# EAGLE design sensor otomatis ldr (EAGLE 6.6.0)
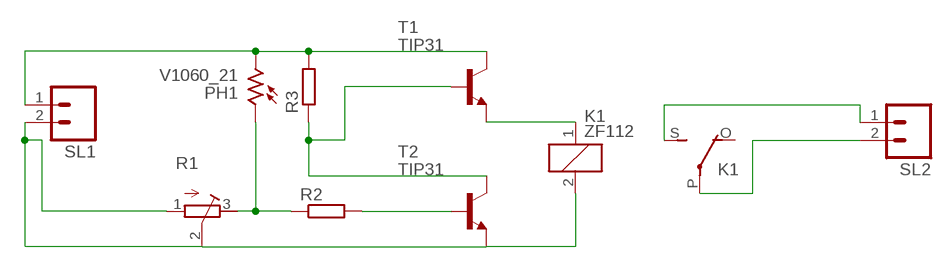
[diagram p0: schematic, sheet 1]

## Parts
K1  ZF112  [ZF112]
PH1  V1060_21  [TO-5_V10]
R1  R-TRIMM3339P  [RTRIM3339P]
R2  R-EU_0207/10  [0207/10]
R3  R-EU_0207/10  [0207/10]
SL1  M02  [02P]
SL2  M02  [02P]
T1  TIP31  [TO220]
T2  TIP31  [TO220]

## Nets
N$1: PH1.2 R3.2 SL1.1 T1.2(C)
N$2: K1.1 T1.3(E)
N$3: R2.2 T2.1(B)
N$4: PH1.1 R1.3(E) R2.1
N$5: R3.1 T1.1(B) T2.2(C)
N$6: K1.2 R1.1(A) R1.2(S) SL1.2 T2.3(E)
N$8: K1.P(2:P) SL2.2
N$10: K1.S(2:S) SL2.1
Unconnected: K1.O(2:O)

## Library data of the parts
K1 = relay:ZF112: RELAY 1 x switch; OC_FARNELL: unknown; OC_NEWARK: unknown
PH1 = photo-elements:?1060*: Sensor Street Light control Source: http://optoelectronics.perkinelmer.com/content/Datasheets/DTS_PhotocellsB1060.pdf
R1 = resistor:R-TRIMM: Trimm resistor
R2 R3 = resistor:R-EU_: RESISTOR, European symbol
SL1 SL2 = con-amp-quick:M02: AMP QUICK CONNECTOR; OC_FARNELL: unknown; OC_NEWARK: unknown
T1 T2 = transistor:TIP31: NPN Transistor Medium Power Linear Switching Applications Source: http://onsemi.com

## Board
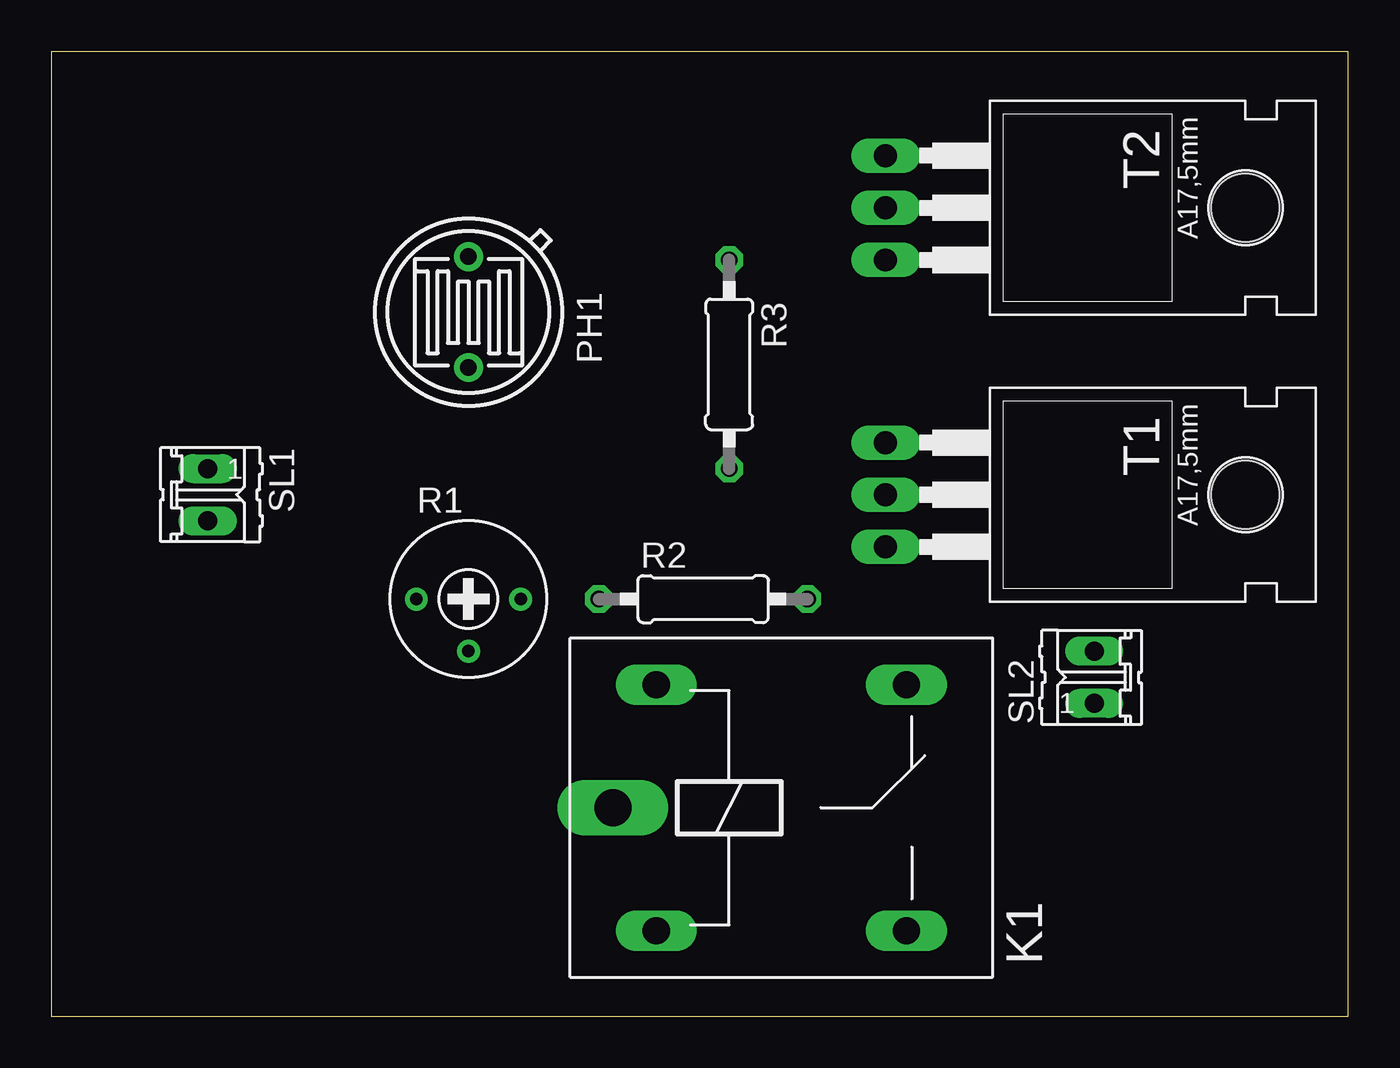
[diagram p1: board, top side]
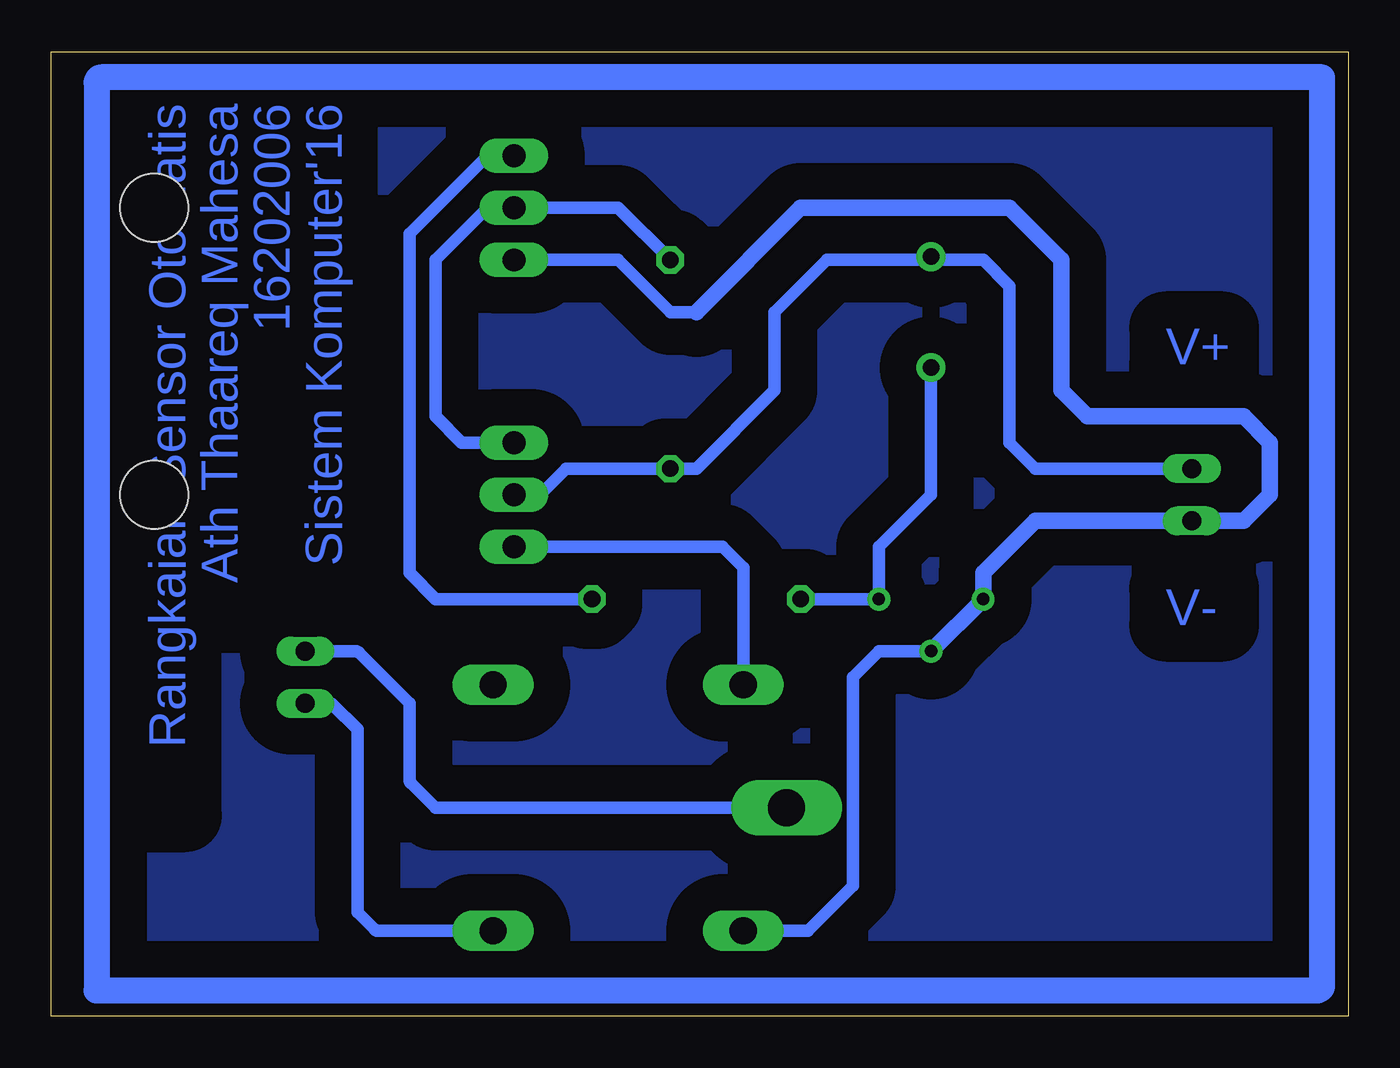
[diagram p2: board, bottom side, seen from below]

Size 63.17 x 46.98 mm. Coordinates in mm from the lower left corner, seen from the top.
Outline: 0,0 63.17,0 63.17,46.98 0,46.98 0,0
Copper layers (1*16): layer 1 0.035mm / dielectric 1.5mm / Bottom 0.035mm
Design rules "default": minimum track width 10mil, minimum drill 24mil, track to track 8mil, track to pad 8mil, pad to pad 8mil, via to via 8mil, smd to smd 8mil, copper to edge 40mil, drill to drill 8mil, minimum pad ring 10mil, minimum via ring 8mil, stop-mask expansion 4mil, vias tented up to drill 0mil, thermal gap 10mil

### Footprints (pad centres in the part's own frame; a part is rotated, then mirrored left to right if it is on the bottom)
ZF112 = drill 1.321 long: 1 -6.096,5.994; 2 -6.096,-5.994; O 6.096,5.994; S 6.096,-5.994 | drill 1.803 long: P -8.204,0
TO-5_V10 = drill 0.8 pad 1.4: 1 -2.7,0; 2 2.7,0
RTRIM3339P = drill 0.61: 1 -2.54,0; 2 0,-2.54; 3 2.54,0
0207/10 = drill 0.813 octagon: 1 -5.08,0; 2 5.08,0
02P = drill 0.914 long: 1 -1.27,0; 2 1.27,0
TO220 = drill 1.118 long: 1 -2.54,-6.35; 2 0,-6.35; 3 2.54,-6.35 | hole 3.302: 0,11.176

### Placement (x,y rotation side)
K1  35.56,10.16 0 top
PH1  20.32,34.29 90 top
R1  20.32,20.32 0 top
R2  31.75,20.32 0 top
R3  33.02,31.75 270 top
SL1  7.62,25.4 270 top
SL2  50.8,16.51 90 top
T1  46.99,25.4 270 top
T2  46.99,39.37 270 top

### Tracks (layer width: path | path; a pad name or v marks a point on that pad's centre or on a via)
N$1
  Bottom 0.61: SL1.1 15.24,26.67 16.51,27.94 16.51,35.56 17.78,36.83 20.16,36.83 PH1.2 20.48,36.83 25.4,36.83 27.94,34.29 27.94,30.48 31.75,26.67 R3.2 38.1,26.67 39.37,25.4 T1.2
N$2
  Bottom 0.61: K1.1 29.46,21.84 30.48,22.86 T1.3
N$3
  Bottom 0.61: T2.1 41.91,41.91 45.72,38.1 45.72,21.59 44.45,20.32 R2.2
N$4
  Bottom 0.61: PH1.1 20.32,25.4 22.86,22.86 R1.3 R2.1
N$5
  Bottom 0.61: T1.1 43.18,27.94 44.45,29.21 44.45,36.83 41.91,39.37 T2.2 35.56,39.37 R3.1
N$6
  Bottom 0.61: T2.3 35.56,36.83 33.02,34.29 31.75,34.29 | R1.2 22.86,17.78 24.13,16.51 24.13,6.35 26.31,4.17 K1.2
  Bottom 0.813: R1.2 R1.1 17.78,21.59 15.24,24.13 SL1.2 5.08,24.13 3.81,25.4 3.81,27.94 5.08,29.21 12.7,29.21 13.97,30.48 13.97,36.83 16.51,39.37 26.67,39.37 31.75,34.29
N$8
  Bottom 0.61: SL2.2 48.37,17.78 arc45 48.19,17.71 45.72,15.24 45.72,11.53 arc-45 45.65,11.36 44.45,10.16 K1.P
N$10
  Bottom 0.61: SL2.1 49.63,15.24 arc45 49.46,15.17 48.26,13.97 48.26,5.08 47.42,4.24 arc-45 47.24,4.17 K1.S
N$11
  pour Bottom (isolate 1.778): 2.54,44.45 2.54,2.54 59.44,2.54 arc90 59.69,2.79 59.69,44.45
N$12
  Bottom 1.27: 1.27,45.72 60.71,45.72 arc-90 60.96,45.47 60.96,1.27 1.52,1.27 arc-90 1.27,1.52 1.27,45.72

### Text on the board
Bottom: Sistem Komputer'16 | 16202006 | Ath Thaareq Mahesa | Rangkaian Sensor Otomatis | V+ | V-